# EAGLE design Extension (EAGLE 7.1.0)

## Sheet 1 of 2
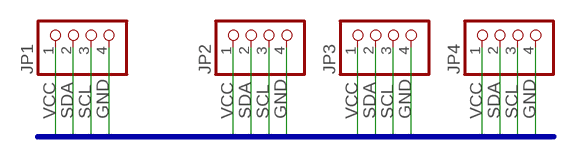
[diagram p0: schematic, sheet 1]

### Parts
JP1  PINHD-1X4  [1X04]
JP2  PINHD-1X4  [1X04]
JP3  PINHD-1X4  [1X04]
JP4  PINHD-1X4  [1X04]

### Nets
GND: JP1.4 JP2.4 JP3.4 JP4.4
SCL: JP1.3 JP2.3 JP3.3 JP4.3
SDA: JP1.2 JP2.2 JP3.2 JP4.2
VCC: JP1.1 JP2.1 JP3.1 JP4.1

### Buses
VCC,GND,SDA,SCL

## Sheet 2 of 2
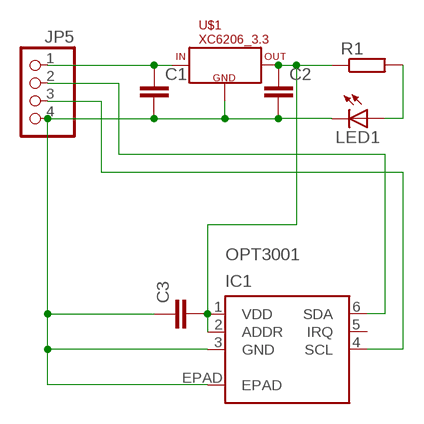
[diagram p1: schematic, sheet 2]

### Parts
C1  C-EUC0805  [C0805]
C2  C-EUC0805  [C0805]
C3  C-EUC0805  [C0805]
IC1  OPT3001  [USON6]
JP5  PINHD-1X4  [1X04]
LED1  LEDCHIPLED_0805  [CHIPLED_0805]
R1  R-EU_R0805  [R0805]
U$1  XC6206_3.3  [SOT23]

### Nets
N$1: C1.1 JP5.1 U$1.3(IN)
N$2: C1.2 C2.2 C3.1 IC1.3(GND) IC1.EPAD JP5.4 LED1.C U$1.1(GND)
N$5: C2.1 C3.2 IC1.1(VDD) IC1.2(ADDR) R1.1 U$1.2(OUT)
N$6: IC1.6(SDA) JP5.2
N$7: IC1.4(SCL) JP5.3
N$8: LED1.A R1.2
Unconnected: IC1.5(IRQ)

## Library data of the parts
C1-C3 = rcl:C-EU: CAPACITOR, European symbol
IC1 = My_TI:OPT3001: OPT3001 edit this description Auto generated by make-symbol-device-package-bsdl.ulp Rev. 43 Source: OPT3001.txt
JP1-JP5 = pinhead:PINHD-1X4: PIN HEADER
LED1 = led:LED: LED OSRAM: - CHIPLED LG R971, LG N971, LY N971, LG Q971, LY Q971, LO R971, LY R971 LH N974, LH R974 LS Q976, LO Q976, LY Q976 LO Q996 - Hyper CHIPLED LW Q18S LB Q993, LB Q99A, LB R99A - SideLED LS A670, LO A670, LY A670, LG A670, LP A670 LB A673, LV A673, LT A673, LW A673 LH A674 LY A675 LS A676, LA A676, LO A676, LY A676, LW A676 LS A679, LY A679, LG A679 - Hyper Micro SIDELED® LS Y876, LA Y876, LO Y876, LY Y876 LT Y87S - SmartLED LW L88C, LW L88S LB L89C, LB L89S, LG L890 LS L89K, LO L89K, LY L89K LS L896, LA L896, LO L896, LY L896 - TOPLED LS T670, LO T670, LY T670, LG T670, LP T670 LSG T670, LSP T670, LSY T670, LOP T670, LYG T670 LG T671, LOG T671, LSG T671 LB T673, LV T673, LT T673, LW T673 LH T674 LS T676, LA T676, LO T676, LY T676, LB T676, LH T676, LSB T676, LW T676 LB T67C, LV T67C, LT T67C, LS T67K, LO T67K, LY T67K, LW E67C LS E67B, LA E67B, LO E67B, LY E67B, LB E67C, LV E67C, LT E67C LW T67C LS T679, LY T679, LG T679 LS T770, LO T770, LY T770, LG T770, LP T770 LB T773, LV T773, LT T773, LW T773 LH T774 LS E675, LA E675, LY E675, LS T675 LS T776, LA T776, LO T776, LY T776, LB T776 LHGB T686 LT T68C, LB T68C - Hyper Mini TOPLED® LB M676 - Mini TOPLED Santana® LG M470 LS M47K, LO M47K, LY M47K Source: http://www.osram.convergy.de LUXEON: - LUMILED® LXK2-PW12-R00, LXK2-PW12-S00, LXK2-PW14-U00, LXK2-PW14-V00 LXK2-PM12-R00, LXK2-PM12-S00, LXK2-PM14-U00 LXK2-PE12-Q00, LXK2-PE12-R00, LXK2-PE12-S00, LXK2-PE14-T00, LXK2-PE14-U00 LXK2-PB12-K00, LXK2-PB12-L00, LXK2-PB12-M00, LXK2-PB14-N00, LXK2-PB14-P00, LXK2-PB14-Q00 LXK2-PR12-L00, LXK2-PR12-M00, LXK2-PR14-Q00, LXK2-PR14-R00 LXK2-PD12-Q00, LXK2-PD12-R00, LXK2-PD12-S00 LXK2-PH12-R00, LXK2-PH12-S00 LXK2-PL12-P00, LXK2-PL12-Q00, LXK2-PL12-R00 Source: www.luxeon.com KINGBRIGHT: KA-3528ASYC Source: www.kingbright.com
R1 = rcl:R-EU_: RESISTOR, European symbol
U$1 = 74xx:XC6206_3.3

## Board
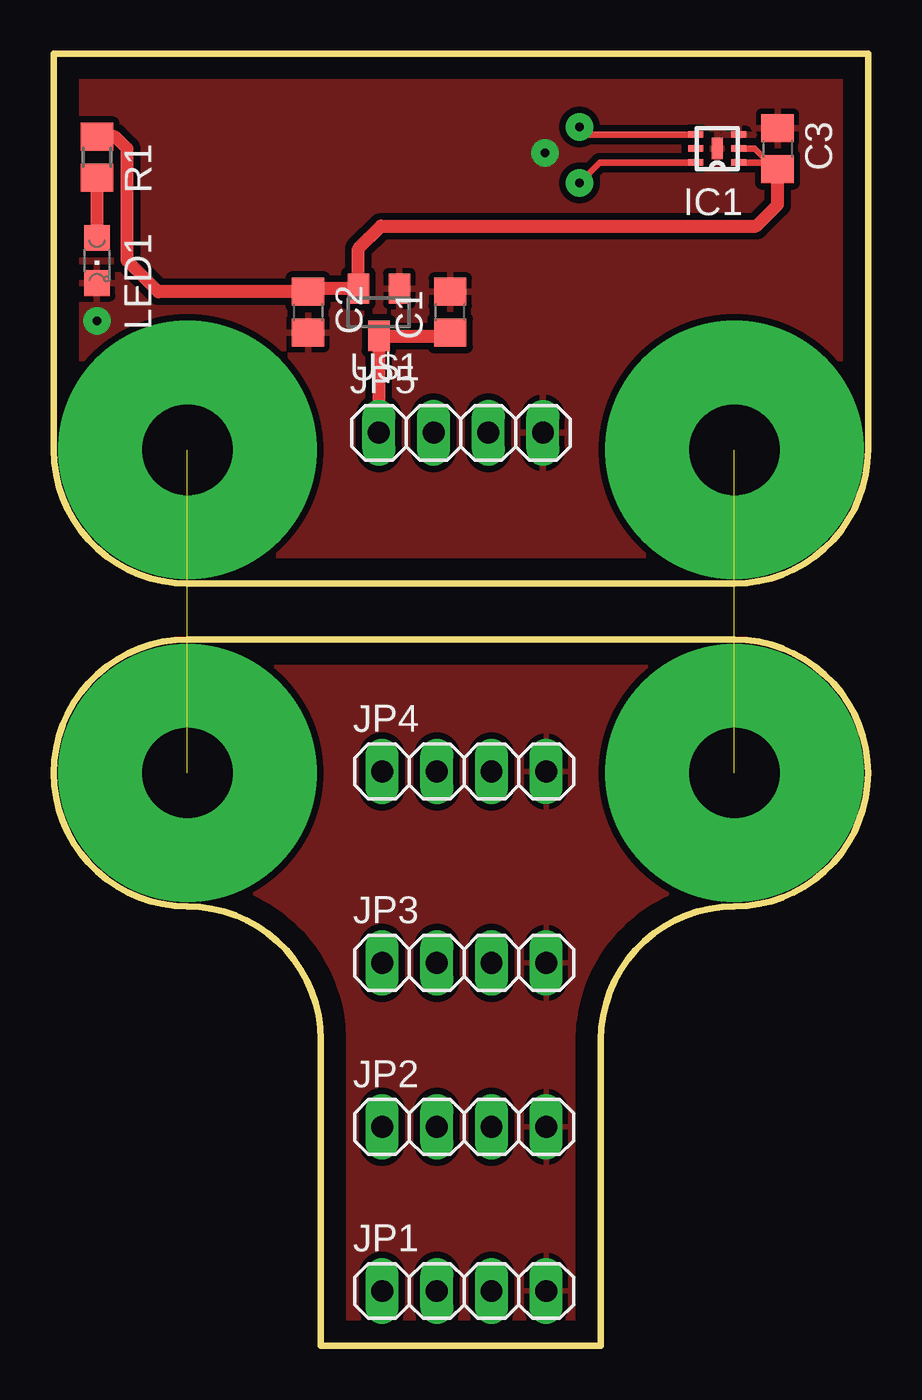
[diagram p2: board, top side]
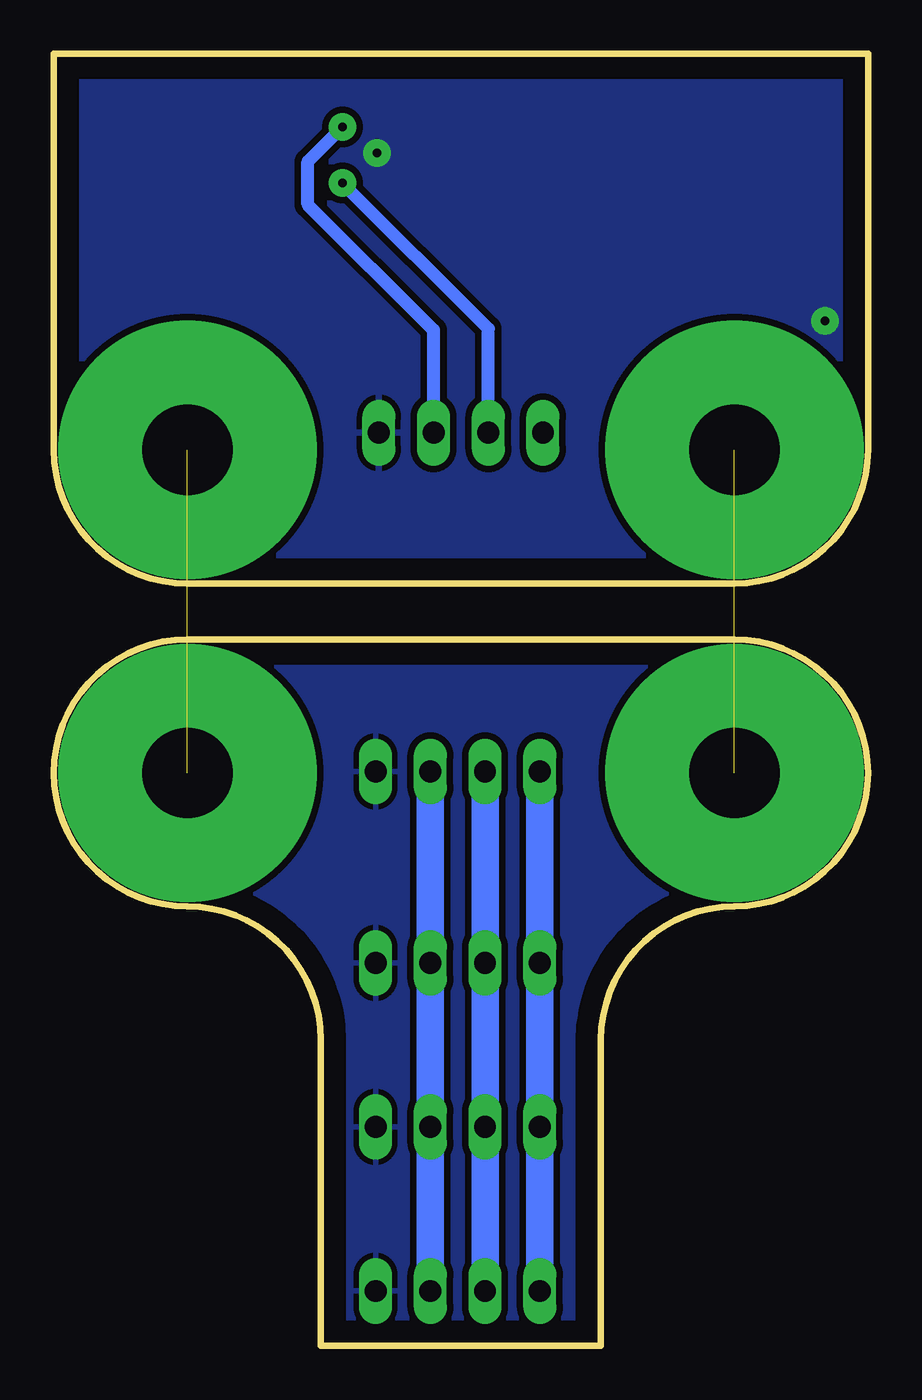
[diagram p3: board, bottom side, seen from below]

Size 37.8 x 60 mm. Coordinates in mm from the lower left corner, seen from the top.
Outline: 6.2,32.8 arc90 0,26.6 arc90 6.2,20.4 arc-90 12.4,14.2 12.4,0 25.4,0 25.4,14.2 arc-90 31.6,20.4 arc90 37.8,26.6 arc90 31.6,32.8 6.2,32.8
Outline: 0,41.6 arc90 6.2,35.4 31.6,35.4 arc90 37.8,41.6 37.8,60 0,60 0,41.6
Copper layers (1*16): Top 0.035mm / dielectric 1.5mm / Bottom 0.035mm
Design rules "default": minimum track width 10mil, minimum drill 24mil, track to track 8mil, track to pad 8mil, pad to pad 8mil, via to via 8mil, smd to smd 8mil, copper to edge 40mil, drill to drill 8mil, minimum pad ring 10mil, minimum via ring 8mil, stop-mask expansion 4mil, vias tented up to drill 0mil, thermal gap 10mil

### Footprints (pad centres in the part's own frame; a part is rotated, then mirrored left to right if it is on the bottom)
C0805 = smd 1.3 x 1.5: 1 -0.95,0; 2 0.95,0
USON6 = smd 0.7 x 0.3: 1 -1,0.65; 2 -1,0; 3 -1,-0.65; 4 1,-0.65; 5 1,0; 6 1,0.65 | smd 0.5 x 1: EPAD 0,0
1X04 = drill 1.016 long: 1 -3.81,0; 2 -1.27,0; 3 1.27,0; 4 3.81,0
CHIPLED_0805 = smd 1.2 x 1.2: A 0,-1.05; C 0,1.05
R0805 = smd 1.3 x 1.5: 1 -0.95,0; 2 0.95,0
SOT23 = smd 1 x 1.4: 1 -0.95,-1.1; 2 0.95,-1.1; 3 0,1.1

### Placement (x,y rotation side)
C1  18.4,48 90 top
C2  11.8,48 270 top
C3  33.6,55.6 270 top
IC1  30.8,55.6 180 top
JP1  19.05,2.54 0 top
JP2  19.05,10.16 0 top
JP3  19.05,17.78 0 top
JP4  19.05,26.67 0 top
JP5  18.9,42.4 0 top
LED1  2,50.4 180 top
R1  2,55.2 270 top
U$1  15.09,48 180 top

### Tracks (layer width: path | path; a pad name or v marks a point on that pad's centre or on a via)
GND
  pour Top (isolate 0.305): 16.6,0 12.4,0 12.4,14.2 arc90 6.2,20.4 6,20.4 arc-90 0,26.4 0,26.6 0,26.8 arc-90 6,32.8 31.6,32.8 arc-90 37.8,26.6 arc-90 31.6,20.4 arc90 25.4,14.2 25.4,0
  pour Bottom (isolate 0.305): 21.2,0 25.4,0 25.4,14.2 arc-90 31.6,20.4 31.8,20.4 arc90 37.8,26.4 37.8,26.6 37.8,26.8 arc90 31.8,32.8 6.2,32.8 arc90 0,26.6 arc90 6.2,20.4 arc-90 12.4,14.2 12.4,0
N$1
  Top 0.61: C1.1 18.25,46.9 U$1.3 JP5.1
N$2  (via drill 0.4 pad 1.27)
  other vias: 2,47.6 22.8,55.4
  pour Top (isolate 0.305): 0,60 37.8,60 37.8,41.6 arc-90 31.6,35.4 6.2,35.4 arc-90 0,41.6
  pour Bottom (isolate 0.305): 37.8,60 0,60 0,41.6 arc90 6.2,35.4 31.6,35.4 arc90 37.8,41.6
N$3  (via drill 4.2 pad 12)  (1 unrouted)
  other vias: 6.2,26.6 6.2,41.6
N$4  (via drill 4.2 pad 12)  (1 unrouted)
  other vias: 31.6,26.6 31.6,41.6
N$5
  Top 0.305: IC1.1 33.2,54.95 | 33.2,54.95 33.3,54.95 C3.2 | IC1.2 32.55,55.6 33.2,54.95
  Top 0.61: R1.1 2.85,56.15 3.4,55.6 3.4,50.4 4.85,48.95 C2.1 11.95,49.1 U$1.2 14.14,50.94 15.2,52 32.6,52 33.6,53 C3.2
N$6  (via drill 0.4 pad 1.27)
  Top 0.305: v24.4,54 25.35,54.95 IC1.6
  Bottom 0.61: JP5.2 17.63,47.23 v24.4,54
N$7  (via drill 0.4 pad 1.27)
  Top 0.305: v24.4,56.6 24.75,56.25 IC1.4
  Bottom 0.61: JP5.3 20.17,47.17 26,53 26,55 v24.4,56.6
N$8
  Top 0.61: R1.2 LED1.A
SCL
  Bottom 1.27: JP4.3 JP3.3 JP2.3 JP1.3
SDA
  Bottom 1.27: JP1.2 JP2.2 JP3.2 JP4.2
VCC
  Bottom 1.27: JP4.1 JP3.1 JP2.1 JP1.1